# Altium project Pannello.PrjPcb
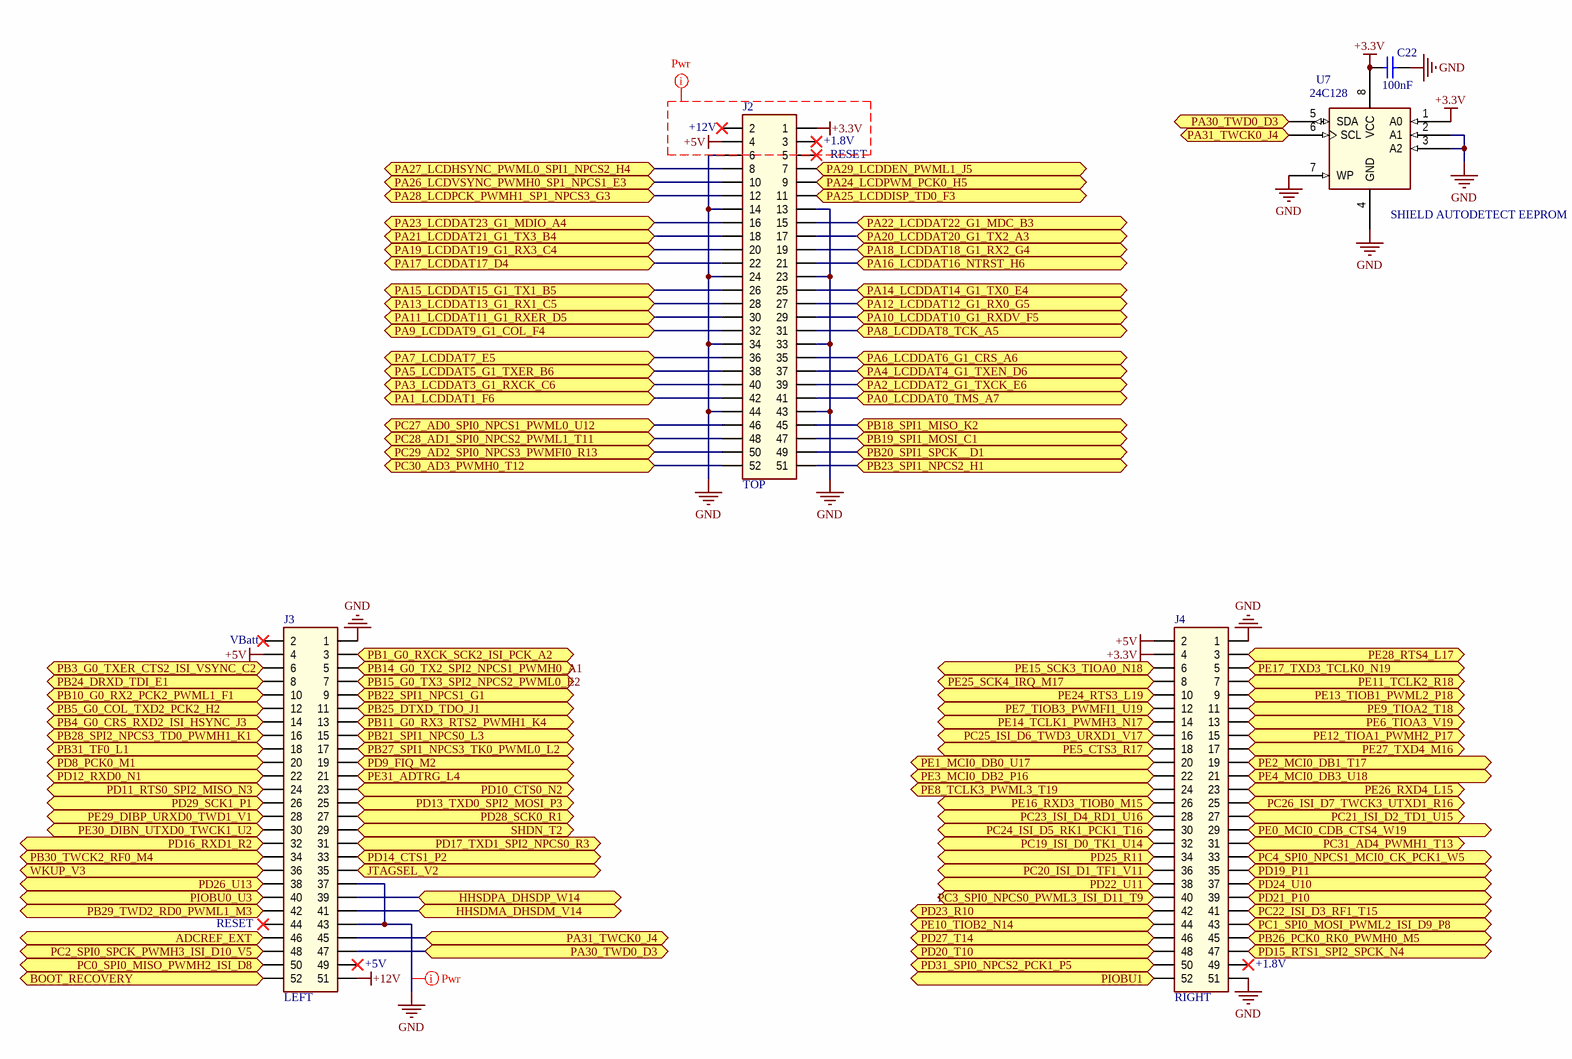
[diagram p0: eva01_connectors.SchDoc]
5 sheets, 242 parts. Net scope: flat (ports and power ports of the same name join across sheets).
Board file: pannello.PcbDoc
Sheets:
  eva01_connectors.SchDoc
  input.SchDoc
  interface.SchDoc
  output.SchDoc
  power.SchDoc

## Sheet eva01_connectors.SchDoc: DevelBoard EVA Main Connectors
size A3; Author: Daniele Basile <asterix@develer.com>; Organization: Develer s.r.l.; Address1: via Mugellese 1/A; Address2: 50019 Campi Bisenzio; Address3: Firenze; Address4: ITALY; DocumentNumber: 1; Revision: EVA 0; SheetNumber: 1; SheetTotal: 3

### Parts
C22  100nF  [0603_[1608]]
J2  TOP  [SOCKET_2x26_2.54MM_THD]
J3  LEFT  [SOCKET_2x26_2.54MM_THD]
J4  RIGHT  [SOCKET_2x26_2.54MM_THD]
U7  24C128  [SOIC8]

### Ports
ADCREF_EXT, BOOT_RECOVERY, HHSDMA_DHSDM_V14, HHSDPA_DHSDP_W14, JTAGSEL_V2, PA0_LCDDAT0_TMS_A7, PA1_LCDDAT1_F6, PA2_LCDDAT2_G1_TXCK_E6, PA3_LCDDAT3_G1_RXCK_C6, PA4_LCDDAT4_G1_TXEN_D6, PA5_LCDDAT5_G1_TXER_B6, PA6_LCDDAT6_G1_CRS_A6, PA7_LCDDAT7_E5, PA8_LCDDAT8_TCK_A5, PA9_LCDDAT9_G1_COL_F4, PA10_LCDDAT10_G1_RXDV_F5, PA11_LCDDAT11_G1_RXER_D5, PA12_LCDDAT12_G1_RX0_G5, PA13_LCDDAT13_G1_RX1_C5, PA14_LCDDAT14_G1_TX0_E4, PA15_LCDDAT15_G1_TX1_B5, PA16_LCDDAT16_NTRST_H6, PA17_LCDDAT17_D4, PA18_LCDDAT18_G1_RX2_G4, PA19_LCDDAT19_G1_RX3_C4, PA20_LCDDAT20_G1_TX2_A3, PA21_LCDDAT21_G1_TX3_B4, PA22_LCDDAT22_G1_MDC_B3, PA23_LCDDAT23_G1_MDIO_A4, PA24_LCDPWM_PCK0_H5, PA25_LCDDISP_TD0_F3, PA26_LCDVSYNC_PWMH0_SP1_NPCS1_E3, PA27_LCDHSYNC_PWML0_SPI1_NPCS2_H4, PA28_LCDPCK_PWMH1_SP1_NPCS3_G3, PA29_LCDDEN_PWML1_J5, PA30_TWD0_D3, PA31_TWCK0_J4, PB1_G0_RXCK_SCK2_ISI_PCK_A2, PB3_G0_TXER_CTS2_ISI_VSYNC_C2, PB4_G0_CRS_RXD2_ISI_HSYNC_J3, PB5_G0_COL_TXD2_PCK2_H2, PB10_G0_RX2_PCK2_PWML1_F1, PB11_G0_RX3_RTS2_PWMH1_K4, PB14_G0_TX2_SPI2_NPCS1_PWMH0_A1, PB15_G0_TX3_SPI2_NPCS2_PWML0_E2, PB18_SPI1_MISO_K2, PB19_SPI1_MOSI_C1, PB20_SPI1_SPCK__D1, PB21_SPI1_NPCS0_L3, PB22_SPI1_NPCS1_G1, PB23_SPI1_NPCS2_H1, PB24_DRXD_TDI_E1, PB25_DTXD_TDO_J1, PB26_PCK0_RK0_PWMH0_M5, PB27_SPI1_NPCS3_TK0_PWML0_L2, PB28_SPI2_NPCS3_TD0_PWMH1_K1, PB29_TWD2_RD0_PWML1_M3, PB30_TWCK2_RF0_M4, PB31_TF0_L1, PC0_SPI0_MISO_PWMH2_ISI_D8, PC1_SPI0_MOSI_PWML2_ISI_D9_P8, PC2_SPI0_SPCK_PWMH3_ISI_D10_V5, PC3_SPI0_NPCS0_PWML3_ISI_D11_T9, PC4_SPI0_NPCS1_MCI0_CK_PCK1_W5, PC19_ISI_D0_TK1_U14, PC20_ISI_D1_TF1_V11, PC21_ISI_D2_TD1_U15, PC22_ISI_D3_RF1_T15, PC23_ISI_D4_RD1_U16, PC24_ISI_D5_RK1_PCK1_T16, PC25_ISI_D6_TWD3_URXD1_V17, PC26_ISI_D7_TWCK3_UTXD1_R16, PC27_AD0_SPI0_NPCS1_PWML0_U12, PC28_AD1_SPI0_NPCS2_PWML1_T11, PC29_AD2_SPI0_NPCS3_PWMFI0_R13, PC30_AD3_PWMH0_T12, PC31_AD4_PWMH1_T13, PD8_PCK0_M1, PD9_FIQ_M2, PD10_CTS0_N2, PD11_RTS0_SPI2_MISO_N3, PD12_RXD0_N1, PD13_TXD0_SPI2_MOSI_P3, PD14_CTS1_P2, PD15_RTS1_SPI2_SPCK_N4, PD16_RXD1_R2, PD17_TXD1_SPI2_NPCS0_R3, PD19_P11, PD20_T10, PD21_P10, PD22_U11, PD23_R10, PD24_U10, PD25_R11, PD26_U13, PD27_T14, PD28_SCK0_R1, PD29_SCK1_P1, PD31_SPI0_NPCS2_PCK1_P5, PE0_MCI0_CDB_CTS4_W19, PE1_MCI0_DB0_U17, PE2_MCI0_DB1_T17, PE3_MCI0_DB2_P16, PE4_MCI0_DB3_U18, PE5_CTS3_R17, PE6_TIOA3_V19, PE7_TIOB3_PWMFI1_U19, PE8_TCLK3_PWML3_T19, PE9_TIOA2_T18, PE10_TIOB2_N14, PE11_TCLK2_R18, PE12_TIOA1_PWMH2_P17, PE13_TIOB1_PWML2_P18, PE14_TCLK1_PWMH3_N17, PE15_SCK3_TIOA0_N18, PE16_RXD3_TIOB0_M15, PE17_TXD3_TCLK0_N19, PE24_RTS3_L19, PE25_SCK4_IRQ_M17, PE26_RXD4_L15, PE27_TXD4_M16, PE28_RTS4_L17, PE29_DIBP_URXD0_TWD1_V1, PE30_DIBN_UTXD0_TWCK1_U2, PE31_ADTRG_L4, PIOBU0_U3, PIOBU1, SHDN_T2, WKUP_V3

### Nets
+3.3V: C22.2 J2.1 J4.4 U7.1(A0) U7.8(VCC)
+5V: J2.4 J3.4 J4.2
+12V: J3.51
GND: C22.1 J2.6 J2.13 J2.14 J2.23 J2.24 J2.33 J2.34 J2.43 J2.44 J3.1 J3.37 J3.43 J4.1 J4.51 U7.2(A1) U7.3(A2) U7.4(GND) U7.7(WP)
NetJ2_7: J2.7 ; port PA29_LCDDEN_PWML1_J5
NetJ2_8: J2.8 ; port PA27_LCDHSYNC_PWML0_SPI1_NPCS2_H4
NetJ2_9: J2.9 ; port PA24_LCDPWM_PCK0_H5
NetJ2_10: J2.10 ; port PA26_LCDVSYNC_PWMH0_SP1_NPCS1_E3
NetJ2_11: J2.11 ; port PA25_LCDDISP_TD0_F3
NetJ2_12: J2.12 ; port PA28_LCDPCK_PWMH1_SP1_NPCS3_G3
NetJ2_15: J2.15 ; port PA22_LCDDAT22_G1_MDC_B3
NetJ2_16: J2.16 ; port PA23_LCDDAT23_G1_MDIO_A4
NetJ2_17: J2.17 ; port PA20_LCDDAT20_G1_TX2_A3
NetJ2_18: J2.18 ; port PA21_LCDDAT21_G1_TX3_B4
NetJ2_19: J2.19 ; port PA18_LCDDAT18_G1_RX2_G4
NetJ2_20: J2.20 ; port PA19_LCDDAT19_G1_RX3_C4
NetJ2_21: J2.21 ; port PA16_LCDDAT16_NTRST_H6
NetJ2_22: J2.22 ; port PA17_LCDDAT17_D4
NetJ2_25: J2.25 ; port PA14_LCDDAT14_G1_TX0_E4
NetJ2_26: J2.26 ; port PA15_LCDDAT15_G1_TX1_B5
NetJ2_27: J2.27 ; port PA12_LCDDAT12_G1_RX0_G5
NetJ2_28: J2.28 ; port PA13_LCDDAT13_G1_RX1_C5
NetJ2_29: J2.29 ; port PA10_LCDDAT10_G1_RXDV_F5
NetJ2_30: J2.30 ; port PA11_LCDDAT11_G1_RXER_D5
NetJ2_31: J2.31 ; port PA8_LCDDAT8_TCK_A5
NetJ2_32: J2.32 ; port PA9_LCDDAT9_G1_COL_F4
NetJ2_35: J2.35 ; port PA6_LCDDAT6_G1_CRS_A6
NetJ2_36: J2.36 ; port PA7_LCDDAT7_E5
NetJ2_37: J2.37 ; port PA4_LCDDAT4_G1_TXEN_D6
NetJ2_38: J2.38 ; port PA5_LCDDAT5_G1_TXER_B6
NetJ2_39: J2.39 ; port PA2_LCDDAT2_G1_TXCK_E6
NetJ2_40: J2.40 ; port PA3_LCDDAT3_G1_RXCK_C6
NetJ2_41: J2.41 ; port PA0_LCDDAT0_TMS_A7
NetJ2_42: J2.42 ; port PA1_LCDDAT1_F6
NetJ2_45: J2.45 ; port PB18_SPI1_MISO_K2
NetJ2_46: J2.46 ; port PC27_AD0_SPI0_NPCS1_PWML0_U12
NetJ2_47: J2.47 ; port PB19_SPI1_MOSI_C1
NetJ2_48: J2.48 ; port PC28_AD1_SPI0_NPCS2_PWML1_T11
NetJ2_49: J2.49 ; port PB20_SPI1_SPCK__D1
NetJ2_50: J2.50 ; port PC29_AD2_SPI0_NPCS3_PWMFI0_R13
NetJ2_51: J2.51 ; port PB23_SPI1_NPCS2_H1
NetJ2_52: J2.52 ; port PC30_AD3_PWMH0_T12
NetJ3_3: J3.3 ; port PB1_G0_RXCK_SCK2_ISI_PCK_A2
NetJ3_5: J3.5 ; port PB14_G0_TX2_SPI2_NPCS1_PWMH0_A1
NetJ3_6: J3.6 ; port PB3_G0_TXER_CTS2_ISI_VSYNC_C2
NetJ3_7: J3.7 ; port PB15_G0_TX3_SPI2_NPCS2_PWML0_E2
NetJ3_8: J3.8 ; port PB24_DRXD_TDI_E1
NetJ3_9: J3.9 ; port PB22_SPI1_NPCS1_G1
NetJ3_10: J3.10 ; port PB10_G0_RX2_PCK2_PWML1_F1
NetJ3_11: J3.11 ; port PB25_DTXD_TDO_J1
NetJ3_12: J3.12 ; port PB5_G0_COL_TXD2_PCK2_H2
NetJ3_13: J3.13 ; port PB11_G0_RX3_RTS2_PWMH1_K4
NetJ3_14: J3.14 ; port PB4_G0_CRS_RXD2_ISI_HSYNC_J3
NetJ3_15: J3.15 ; port PB21_SPI1_NPCS0_L3
NetJ3_16: J3.16 ; port PB28_SPI2_NPCS3_TD0_PWMH1_K1
NetJ3_17: J3.17 ; port PB27_SPI1_NPCS3_TK0_PWML0_L2
NetJ3_18: J3.18 ; port PB31_TF0_L1
NetJ3_19: J3.19 ; port PD9_FIQ_M2
NetJ3_20: J3.20 ; port PD8_PCK0_M1
NetJ3_21: J3.21 ; port PE31_ADTRG_L4
NetJ3_22: J3.22 ; port PD12_RXD0_N1
NetJ3_23: J3.23 ; port PD10_CTS0_N2
NetJ3_24: J3.24 ; port PD11_RTS0_SPI2_MISO_N3
NetJ3_25: J3.25 ; port PD13_TXD0_SPI2_MOSI_P3
NetJ3_26: J3.26 ; port PD29_SCK1_P1
NetJ3_27: J3.27 ; port PD28_SCK0_R1
NetJ3_28: J3.28 ; port PE29_DIBP_URXD0_TWD1_V1
NetJ3_29: J3.29 ; port SHDN_T2
NetJ3_30: J3.30 ; port PE30_DIBN_UTXD0_TWCK1_U2
NetJ3_31: J3.31 ; port PD17_TXD1_SPI2_NPCS0_R3
NetJ3_32: J3.32 ; port PD16_RXD1_R2
NetJ3_33: J3.33 ; port PD14_CTS1_P2
NetJ3_34: J3.34 ; port PB30_TWCK2_RF0_M4
NetJ3_35: J3.35 ; port JTAGSEL_V2
NetJ3_36: J3.36 ; port WKUP_V3
NetJ3_38: J3.38 ; port PD26_U13
NetJ3_39: J3.39 ; port HHSDPA_DHSDP_W14
NetJ3_40: J3.40 ; port PIOBU0_U3
NetJ3_41: J3.41 ; port HHSDMA_DHSDM_V14
NetJ3_42: J3.42 ; port PB29_TWD2_RD0_PWML1_M3
NetJ3_45: J3.45 U7.6(SCL) ; port PA31_TWCK0_J4
NetJ3_46: J3.46 ; port ADCREF_EXT
NetJ3_47: J3.47 U7.5(SDA) ; port PA30_TWD0_D3
NetJ3_48: J3.48 ; port PC2_SPI0_SPCK_PWMH3_ISI_D10_V5
NetJ3_50: J3.50 ; port PC0_SPI0_MISO_PWMH2_ISI_D8
NetJ3_52: J3.52 ; port BOOT_RECOVERY
NetJ4_3: J4.3 ; port PE28_RTS4_L17
NetJ4_5: J4.5 ; port PE17_TXD3_TCLK0_N19
NetJ4_6: J4.6 ; port PE15_SCK3_TIOA0_N18
NetJ4_7: J4.7 ; port PE11_TCLK2_R18
NetJ4_8: J4.8 ; port PE25_SCK4_IRQ_M17
NetJ4_9: J4.9 ; port PE13_TIOB1_PWML2_P18
NetJ4_10: J4.10 ; port PE24_RTS3_L19
NetJ4_11: J4.11 ; port PE9_TIOA2_T18
NetJ4_12: J4.12 ; port PE7_TIOB3_PWMFI1_U19
NetJ4_13: J4.13 ; port PE6_TIOA3_V19
NetJ4_14: J4.14 ; port PE14_TCLK1_PWMH3_N17
NetJ4_15: J4.15 ; port PE12_TIOA1_PWMH2_P17
NetJ4_16: J4.16 ; port PC25_ISI_D6_TWD3_URXD1_V17
NetJ4_17: J4.17 ; port PE27_TXD4_M16
NetJ4_18: J4.18 ; port PE5_CTS3_R17
NetJ4_19: J4.19 ; port PE2_MCI0_DB1_T17
NetJ4_20: J4.20 ; port PE1_MCI0_DB0_U17
NetJ4_21: J4.21 ; port PE4_MCI0_DB3_U18
NetJ4_22: J4.22 ; port PE3_MCI0_DB2_P16
NetJ4_23: J4.23 ; port PE26_RXD4_L15
NetJ4_24: J4.24 ; port PE8_TCLK3_PWML3_T19
NetJ4_25: J4.25 ; port PC26_ISI_D7_TWCK3_UTXD1_R16
NetJ4_26: J4.26 ; port PE16_RXD3_TIOB0_M15
NetJ4_27: J4.27 ; port PC21_ISI_D2_TD1_U15
NetJ4_28: J4.28 ; port PC23_ISI_D4_RD1_U16
NetJ4_29: J4.29 ; port PE0_MCI0_CDB_CTS4_W19
NetJ4_30: J4.30 ; port PC24_ISI_D5_RK1_PCK1_T16
NetJ4_31: J4.31 ; port PC31_AD4_PWMH1_T13
NetJ4_32: J4.32 ; port PC19_ISI_D0_TK1_U14
NetJ4_33: J4.33 ; port PC4_SPI0_NPCS1_MCI0_CK_PCK1_W5
NetJ4_34: J4.34 ; port PD25_R11
NetJ4_35: J4.35 ; port PD19_P11
NetJ4_36: J4.36 ; port PC20_ISI_D1_TF1_V11
NetJ4_37: J4.37 ; port PD24_U10
NetJ4_38: J4.38 ; port PD22_U11
NetJ4_39: J4.39 ; port PD21_P10
NetJ4_40: J4.40 ; port PC3_SPI0_NPCS0_PWML3_ISI_D11_T9
NetJ4_41: J4.41 ; port PC22_ISI_D3_RF1_T15
NetJ4_42: J4.42 ; port PD23_R10
NetJ4_43: J4.43 ; port PC1_SPI0_MOSI_PWML2_ISI_D9_P8
NetJ4_44: J4.44 ; port PE10_TIOB2_N14
NetJ4_45: J4.45 ; port PB26_PCK0_RK0_PWMH0_M5
NetJ4_46: J4.46 ; port PD27_T14
NetJ4_47: J4.47 ; port PD15_RTS1_SPI2_SPCK_N4
NetJ4_48: J4.48 ; port PD20_T10
NetJ4_50: J4.50 ; port PD31_SPI0_NPCS2_PCK1_P5
NetJ4_52: J4.52 ; port PIOBU1

Not connected (* = marked no-connect by the designer): J2 2* 3* 5*; J3 2* 44* 49*; J4 49*

### Layout directives
net class Power: +3.3V, +5V, GND

### Notes on the sheet
- (near J2) +12V
- (near J2) +1.8V
- (near J2) RESET
- (near U7) SHIELD AUTODETECT EEPROM
- (near J3) VBatt
- (near J3) RESET
- (near J3) +5V
- (near J4) +1.8V
- Title:
- Author:
- License:
- BSD
- Rev:
- Size:
- A3
- File:
- Date:
- Time:
- Sheet
- of

### Library data of the parts
C22 = Cap: Ceramic X7R 50V; Value: 10nF; Published: 8-Jun-2000; Revision: July-2002: Re-released for DXP Platform.; Publisher: Altium Limited
J2-J4 = Header 26x2: Socket Header, 52 pin, 26x2, 2.54mm, H=8.5mm; Part Number: Tyco 1-1634688; Purchase Code: RS 473-8254
U7 = EEPROM-SOIC8: EEPROM

## Sheet input.SchDoc: PISO input board
size A3; Author: Francesco Sacchi <batt@develer.com>; Organization: Develer s.r.l.; Address1: via Mugellese 1/A; Address2: 50019 Campi Bisenzio; Address3: Firenze; Address4: ITALY; DocumentNumber: 1; Revision: 0; SheetNumber: 1; SheetTotal: 6
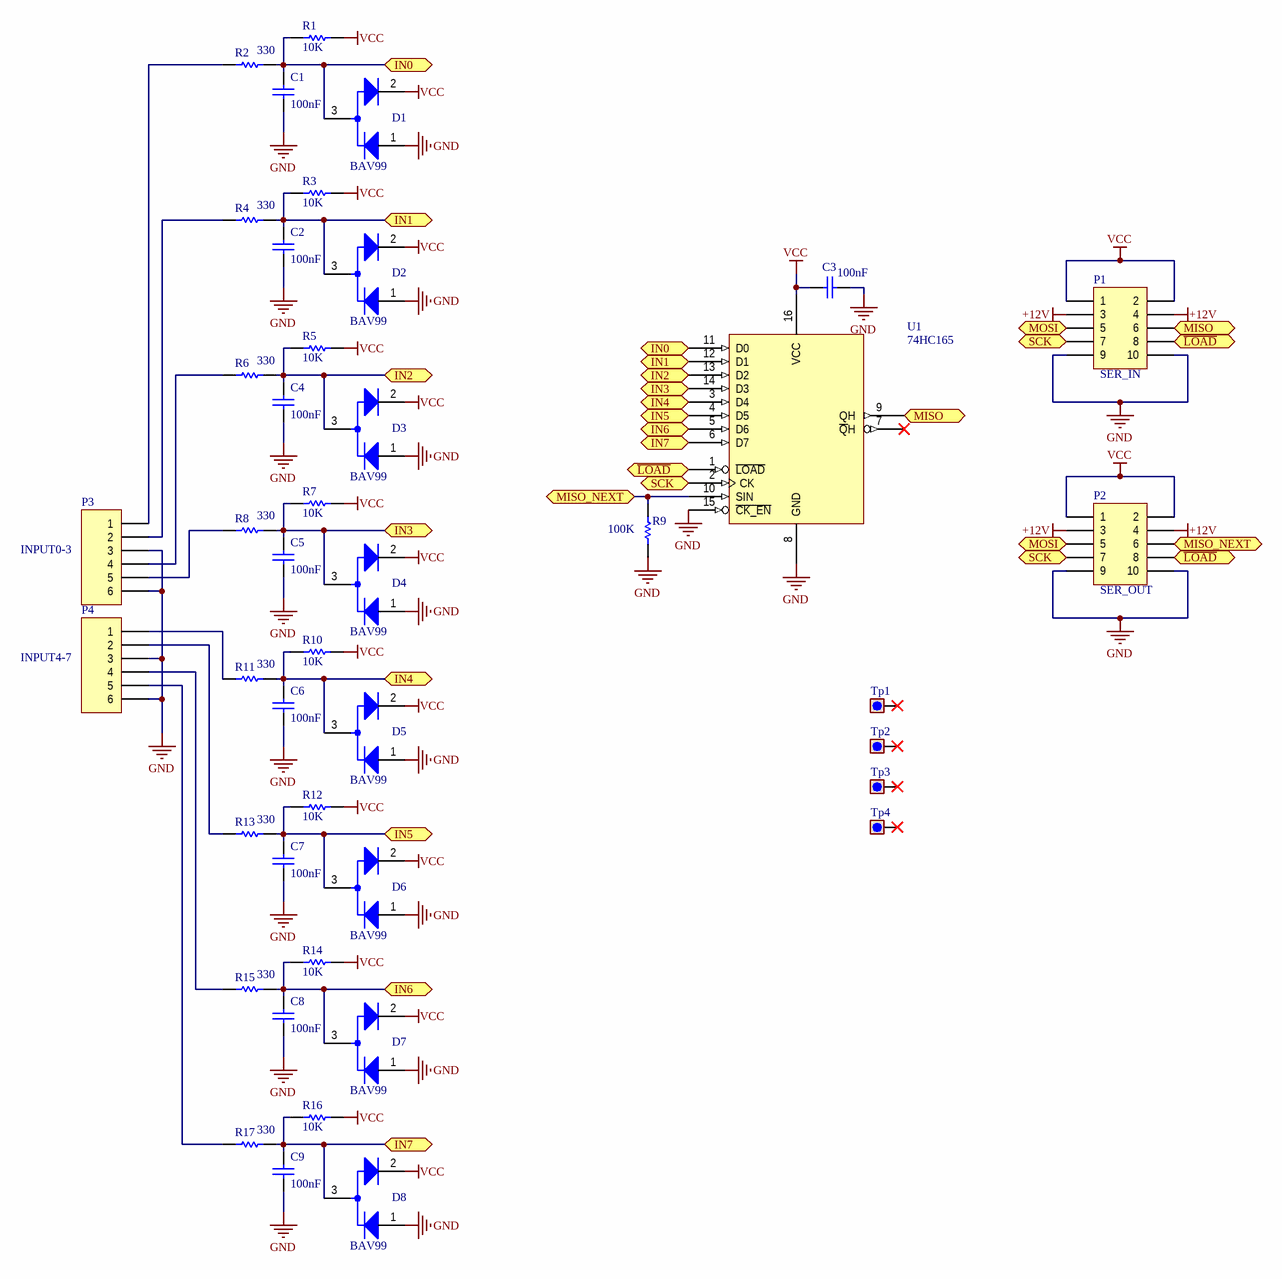
[diagram p1: input.SchDoc]

### Parts
(Parts that share a designator on the sheet are numbered #1, #2 ... from top to bottom, then left to right.)
C1#1  100nF  [0603_[1608]]
C2#1  100nF  [0603_[1608]]
C3#1  100nF  [0603_[1608]]
C4#1  100nF  [0603_[1608]]
C5#1  100nF  [0603_[1608]]
C6#1  100nF  [0603_[1608]]
C7#1  100nF  [0603_[1608]]
C8#1  100nF  [0603_[1608]]
C9#1  100nF  [0603_[1608]]
D1#1  BAV99  [SOT-23]
D2#1  BAV99  [SOT-23]
D3#1  BAV99  [SOT-23]
D4#1  BAV99  [SOT-23]
D5#1  BAV99  [SOT-23]
D6#1  BAV99  [SOT-23]
D7  BAV99  [SOT-23]
D8  BAV99  [SOT-23]
P1#1  SER_IN  [HEADER_2X5_2.54MM_THD_BOXED]
P2#1  SER_OUT  [HEADER_2X5_2.54MM_THD_BOXED]
P3#1  INPUT0-3  [TBLOCK_1X6_3.5MM_HOR_THD]
P4#1  INPUT4-7  [TBLOCK_1X6_3.5MM_HOR_THD]
R1#1  10K  [0603_[1608]]
R2#1  330  [0603_[1608]]
R3#1  10K  [0603_[1608]]
R4#1  330  [0603_[1608]]
R5#1  10K  [0603_[1608]]
R6#1  330  [0603_[1608]]
R7#1  10K  [0603_[1608]]
R8#1  330  [0603_[1608]]
R9#1  100K  [0603_[1608]]
R10#1  10K  [0603_[1608]]
R11#1  330  [0603_[1608]]
R12#1  10K  [0603_[1608]]
R13#1  330  [0603_[1608]]
R14#1  10K  [0603_[1608]]
R15#1  330  [0603_[1608]]
R16#1  10K  [0603_[1608]]
R17#1  330  [0603_[1608]]
Tp1#1  (no value)  [Hole_M3x6mm]  (no BOM)
Tp2#1  (no value)  [Hole_M3x6mm]  (no BOM)
Tp3#1  (no value)  [Hole_M3x6mm]  (no BOM)
Tp4#1  (no value)  [Hole_M3x6mm]  (no BOM)
U1#1  74HC165  [SOIC16]

### Ports
IN0, IN1, IN2, IN3, IN4, IN5, IN6, IN7, MISO, MISO_NEXT, MOSI, SCK, ~{LOAD}

### Nets
+12V: P1#1.3 P1#1.4 P2#1.3 P2#1.4
GND: C1#1.1 C2#1.1 C3#1.1 C4#1.1 C5#1.1 C6#1.1 C7#1.1 C8#1.1 C9#1.1 D1#1.1 D2#1.1 D3#1.1 D4#1.1 D5#1.1 D6#1.1 D7.1 D8.1 P1#1.9 P1#1.10 P2#1.9 P2#1.10 P3#1.3 P3#1.6 P4#1.3 P4#1.6 R9#1.1 U1#1.8(GND) U1#1.15(~{CK_EN})
VCC: C3#1.2 D1#1.2 D2#1.2 D3#1.2 D4#1.2 D5#1.2 D6#1.2 D7.2 D8.2 P1#1.1 P1#1.2 P2#1.1 P2#1.2 R1#1.2 R3#1.2 R5#1.2 R7#1.2 R10#1.2 R12#1.2 R14#1.2 R16#1.2 U1#1.16(VCC)
NetC1#1_2: C1#1.2 D1#1.3 R1#1.1 R2#1.1 U1#1.11(D0) ; port IN0
NetC2#1_2: C2#1.2 D2#1.3 R3#1.1 R4#1.1 U1#1.12(D1) ; port IN1
NetC4#1_2: C4#1.2 D3#1.3 R5#1.1 R6#1.1 U1#1.13(D2) ; port IN2
NetC5#1_2: C5#1.2 D4#1.3 R7#1.1 R8#1.1 U1#1.14(D3) ; port IN3
NetC6#1_2: C6#1.2 D5#1.3 R10#1.1 R11#1.1 U1#1.3(D4) ; port IN4
NetC7#1_2: C7#1.2 D6#1.3 R12#1.1 R13#1.1 U1#1.4(D5) ; port IN5
NetC8#1_2: C8#1.2 D7.3 R14#1.1 R15#1.1 U1#1.5(D6) ; port IN6
NetC9#1_2: C9#1.2 D8.3 R16#1.1 R17#1.1 U1#1.6(D7) ; port IN7
NetP1#1_5: P1#1.5 P2#1.5 ; port MOSI
NetP1#1_6: P1#1.6 U1#1.9(QH) ; port MISO
NetP1#1_7: P1#1.7 P2#1.7 U1#1.2(CK) ; port SCK
NetP1#1_8: P1#1.8 P2#1.8 U1#1.1(~{LOAD}) ; port ~{LOAD}
NetP2#1_6: P2#1.6 R9#1.2 U1#1.10(SIN) ; port MISO_NEXT
NetP3#1_1: P3#1.1 R2#1.2
NetP3#1_2: P3#1.2 R4#1.2
NetP3#1_4: P3#1.4 R6#1.2
NetP3#1_5: P3#1.5 R8#1.2
NetP4#1_1: P4#1.1 R11#1.2
NetP4#1_2: P4#1.2 R13#1.2
NetP4#1_4: P4#1.4 R15#1.2
NetP4#1_5: P4#1.5 R17#1.2

Not connected (* = marked no-connect by the designer): Tp1#1 1*; Tp2#1 1*; Tp3#1 1*; Tp4#1 1*; U1#1 7(~{Q}H)*

### Notes on the sheet
- Title:
- Author:
- License:
- BSD
- Rev:
- Size:
- A3
- File:
- Date:
- Time:
- Sheet
- of

### Library data of the parts
C1#1 C2#1 C3#1 C4#1 C5#1 C6#1 C7#1 C8#1 C9#1 = Cap: Ceramic X5R 6.3V, 10V; Value: 10nF; Published: 8-Jun-2000; Revision: July-2002: Re-released for DXP Platform.; Publisher: Altium Limited
D1#1 D2#1 D3#1 D4#1 D5#1 D6#1 D7 D8 = BAV99: SOT23
P1#1 P2#1 = Header 5X2: Header, 5-Pin, Dual row; LatestRevisionDate: 17-Jul-2002; LatestRevisionNote: Re-released for DXP Platform.; Publisher: Altium Limited
P3#1 P4#1 = Header 6: Header, 6-Pin; LatestRevisionDate: 17-Jul-2002; LatestRevisionNote: Re-released for DXP Platform.; Publisher: Altium Limited
R1#1 R2#1 R3#1 R4#1 R5#1 R6#1 R7#1 R8#1 R9#1 R10#1 R11#1 R12#1 R13#1 R14#1 R15#1 R16#1 R17#1 = Res1: Resistor; Value: 1K; Published: 8-Jun-2000; Revision: July-2002: Re-released for DXP Platform.; Publisher: Altium Limited
Tp1#1 Tp2#1 Tp3#1 Tp4#1 = Test_point

## Sheet interface.SchDoc: Interface
size A3; Author: Francesco Sacchi <batt@develer.com>; Organization: Develer s.r.l.; Address1: via Mugellese 1/A; Address2: 50019 Campi Bisenzio; Address3: Firenze; Address4: ITALY; DocumentNumber: 1; Revision: 0; SheetNumber: 1; SheetTotal: 6
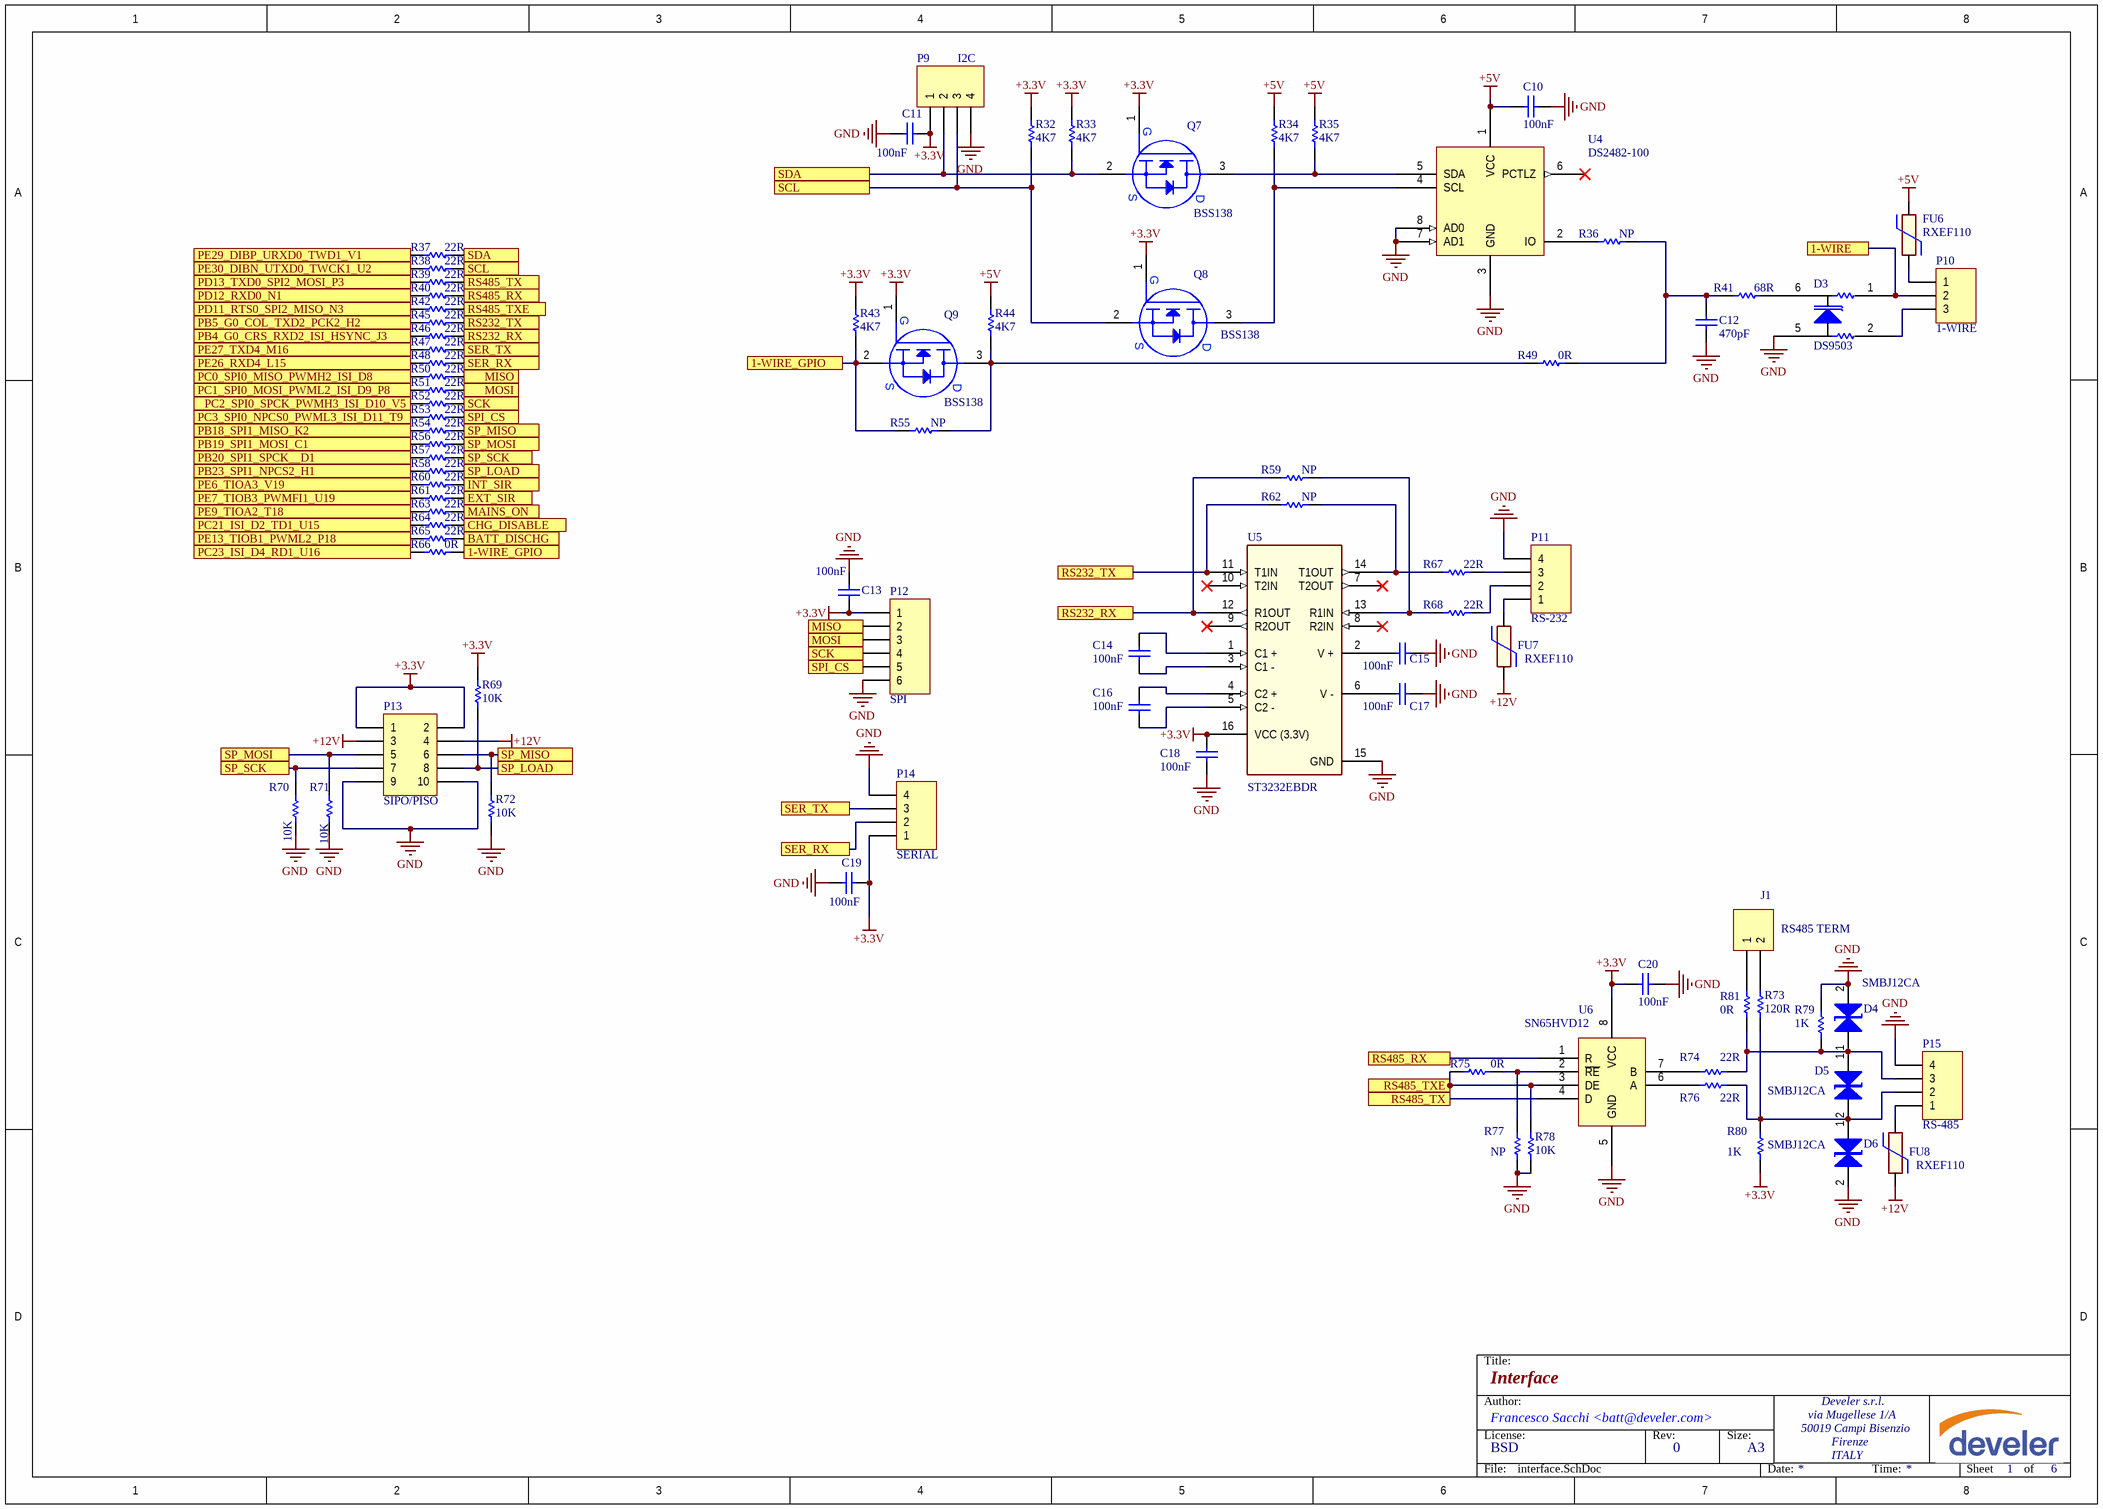
[diagram p2: interface.SchDoc]

### Parts
(Parts that share a designator on the sheet are numbered #1, #2 ... from top to bottom, then left to right.)
C10  100nF  [0603_[1608]]
C11  100nF  [0603_[1608]]
C12  470pF  [0603_[1608]]
C13  100nF  [0603_[1608]]
C14  100nF  [0603_[1608]]
C15  100nF  [0603_[1608]]
C16  100nF  [0603_[1608]]
C17  100nF  [0603_[1608]]
C18  100nF  [0603_[1608]]
C19  100nF  [0603_[1608]]
C20  100nF  [0603_[1608]]
D3#2  DS9503  [TSOC6]
D4#2  SMBJ12CA  [DO214AA_12]
D5#2  SMBJ12CA  [DO214AA_12]
D6#2  SMBJ12CA  [DO214AA_12]
FU6  RXEF110  [RADIAL_5.08mm_polyswitch]
FU7  RXEF110  [RADIAL_5.08mm_polyswitch]
FU8  RXEF110  [RADIAL_5.08mm_polyswitch]
J1  RS485 TERM  [HEADER_1X2_2.54MM_THD]
P9  I2C  [HEADER_1X4_2.54MM_THD]
P10  1-WIRE  [TBLOCK_1X3_3.5MM_HOR_THD]
P11  RS-232  [TBLOCK_1X4_3.5MM_HOR_THD]
P12  SPI  [HEADER_1X6_2.54MM_THD]
P13  SIPO/PISO  [HEADER_2X5_2.54MM_THD_BOXED]
P14  SERIAL  [HEADER_1X4_2.54MM_THD]
P15  RS-485  [TBLOCK_1X4_3.5MM_HOR_THD]
Q7  BSS138  [sot-23]
Q8  BSS138  [sot-23]
Q9  BSS138  [sot-23]
R32  4K7  [0603_[1608]]
R33  4K7  [0603_[1608]]
R34  4K7  [0603_[1608]]
R35  4K7  [0603_[1608]]
R36  NP  [0603_[1608]]
R37  22R  [0603_[1608]]
R38  22R  [0603_[1608]]
R39  22R  [0603_[1608]]
R40  22R  [0603_[1608]]
R41  68R  [0603_[1608]]
R42  22R  [0603_[1608]]
R43  4K7  [0603_[1608]]
R44  4K7  [0603_[1608]]
R45  22R  [0603_[1608]]
R46  22R  [0603_[1608]]
R47  22R  [0603_[1608]]
R48  22R  [0603_[1608]]
R49  0R  [0603_[1608]]
R50  22R  [0603_[1608]]
R51  22R  [0603_[1608]]
R52  22R  [0603_[1608]]
R53  22R  [0603_[1608]]
R54  22R  [0603_[1608]]
R55  NP  [0603_[1608]]
R56  22R  [0603_[1608]]
R57  22R  [0603_[1608]]
R58  22R  [0603_[1608]]
R59  NP  [0603_[1608]]
R60  22R  [0603_[1608]]
R61  22R  [0603_[1608]]
R62  NP  [0603_[1608]]
R63  22R  [0603_[1608]]
R64  22R  [0603_[1608]]
R65  22R  [0603_[1608]]
R66  0R  [0603_[1608]]
R67  22R  [0603_[1608]]
R68  22R  [0603_[1608]]
R69  10K  [0603_[1608]]
R70  10K  [0603_[1608]]
R71  10K  [0603_[1608]]
R72  10K  [0603_[1608]]
R73  120R  [0603_[1608]]
R74  22R  [0603_[1608]]
R75  0R  [0603_[1608]]
R76  22R  [0603_[1608]]
R77  NP  [0603_[1608]]
R78  10K  [0603_[1608]]
R79  1K  [0603_[1608]]
R80  1K  [0603_[1608]]
R81  0R  [0603_[1608]]
U4  DS2482-100  [SOIC8]
U5  ST3232EBDR  [SOIC16]
U6  SN65HVD12  [SOIC8]

### Ports
1-WIRE, 1-WIRE_GPIO, BATT_DISCHG, CHG_DISABLE, EXT_SIR, INT_SIR, MAINS_ON, MISO, MOSI, PB4_G0_CRS_RXD2_ISI_HSYNC_J3, PB5_G0_COL_TXD2_PCK2_H2, PB18_SPI1_MISO_K2, PB19_SPI1_MOSI_C1, PB20_SPI1_SPCK__D1, PB23_SPI1_NPCS2_H1, PC0_SPI0_MISO_PWMH2_ISI_D8, PC1_SPI0_MOSI_PWML2_ISI_D9_P8, PC2_SPI0_SPCK_PWMH3_ISI_D10_V5, PC3_SPI0_NPCS0_PWML3_ISI_D11_T9, PC21_ISI_D2_TD1_U15, PC23_ISI_D4_RD1_U16, PD11_RTS0_SPI2_MISO_N3, PD12_RXD0_N1, PD13_TXD0_SPI2_MOSI_P3, PE6_TIOA3_V19, PE7_TIOB3_PWMFI1_U19, PE9_TIOA2_T18, PE13_TIOB1_PWML2_P18, PE26_RXD4_L15, PE27_TXD4_M16, PE29_DIBP_URXD0_TWD1_V1, PE30_DIBN_UTXD0_TWCK1_U2, RS232_RX, RS232_TX, RS485_RX, RS485_TX, RS485_TXE, SCK, SCL, SDA, SER_RX, SER_TX, SP_LOAD, SP_MISO, SP_MOSI, SP_SCK, SPI_CS

### Nets
+3.3V: C11.2 C13.2 C18.2 C19.2 C20.2 P9.1 P12.1 P13.1 P13.2 P14.1 Q7.1(G) Q8.1(G) Q9.1(G) R32.2 R33.2 R43.2 R69.2 R80.1 U5.16(VCC_(3.3V)) U6.8(VCC)
+5V: C10.2 FU6.1 R34.2 R35.2 R44.2 U4.1(VCC)
+12V: FU7.1 FU8.1 P13.3 P13.4
GND: C10.1 C11.1 C12.2 C13.1 C15.1 C17.1 C18.1 C19.1 C20.1 D3#2.5 D4#2.2 D6#2.2 P9.4 P11.4 P12.6 P13.9 P13.10 P14.4 P15.4 R70.1 R71.1 R72.1 R77.1 R78.1 R79.2 U4.3(GND) U4.7(AD1) U4.8(AD0) U5.15(GND) U6.5(GND)
NetC12_1: C12.1 R36.2 R41.1 R49.2
NetC14_1: C14.1 U5.1(C1_+)
NetC14_2: C14.2 U5.3(C1_-)
NetC15_2: C15.2 U5.2(V_+)
NetC16_1: C16.1 U5.5(C2_-)
NetC16_2: C16.2 U5.4(C2_+)
NetC17_2: C17.2 U5.6(V_-)
NetD3#2_1: D3#2.1 P10.2 ; port 1-WIRE
NetD3#2_2: D3#2.2 P10.3
NetD3#2_6: D3#2.6 R41.2
NetD4#2_1: D4#2.1 D5#2.1 P15.3 R74.2 R79.1 R81.2
NetD5#2_2: D5#2.2 D6#2.1 P15.2 R73.2 R76.2 R80.2
NetDZ4_3: R63.2 ; port MAINS_ON
NetFU6_2: FU6.2 P10.1
NetFU7_2: FU7.2 P11.1
NetFU8_2: FU8.2 P15.1
NetJ1_1: J1.1 R81.1
NetJ1_2: J1.2 R73.1
NetJ2_45: R54.1 ; port PB18_SPI1_MISO_K2
NetJ2_47: R56.1 ; port PB19_SPI1_MOSI_C1
NetJ2_49: R57.1 ; port PB20_SPI1_SPCK__D1
NetJ2_51: R58.1 ; port PB23_SPI1_NPCS2_H1
NetJ3_12: R45.1 ; port PB5_G0_COL_TXD2_PCK2_H2
NetJ3_14: R46.1 ; port PB4_G0_CRS_RXD2_ISI_HSYNC_J3
NetJ3_22: R40.1 ; port PD12_RXD0_N1
NetJ3_24: R42.1 ; port PD11_RTS0_SPI2_MISO_N3
NetJ3_25: R39.1 ; port PD13_TXD0_SPI2_MOSI_P3
NetJ3_28: R37.1 ; port PE29_DIBP_URXD0_TWD1_V1
NetJ3_30: R38.1 ; port PE30_DIBN_UTXD0_TWCK1_U2
NetJ3_48: R52.1 ; port PC2_SPI0_SPCK_PWMH3_ISI_D10_V5
NetJ3_50: R50.1 ; port PC0_SPI0_MISO_PWMH2_ISI_D8
NetJ4_9: R65.1 ; port PE13_TIOB1_PWML2_P18
NetJ4_11: R63.1 ; port PE9_TIOA2_T18
NetJ4_12: R61.1 ; port PE7_TIOB3_PWMFI1_U19
NetJ4_13: R60.1 ; port PE6_TIOA3_V19
NetJ4_17: R47.1 ; port PE27_TXD4_M16
NetJ4_23: R48.1 ; port PE26_RXD4_L15
NetJ4_27: R64.1 ; port PC21_ISI_D2_TD1_U15
NetJ4_28: R66.1 ; port PC23_ISI_D4_RD1_U16
NetJ4_40: R53.1 ; port PC3_SPI0_NPCS0_PWML3_ISI_D11_T9
NetJ4_43: R51.1 ; port PC1_SPI0_MOSI_PWML2_ISI_D9_P8
NetP1#1_5: P12.3 R51.2 ; port MOSI
NetP1#1_6: P12.2 R50.2 ; port MISO
NetP1#1_7: P12.4 R52.2 ; port SCK
NetP9_2: P9.2 Q7.2(S) R33.1 R37.2 ; port SDA
NetP9_3: P9.3 Q8.2(S) R32.1 R38.2 ; port SCL
NetP11_2: P11.2 R68.2
NetP11_3: P11.3 R67.2
NetP12_5: P12.5 R53.2 ; port SPI_CS
NetP13_5: P13.5 R56.2 R71.2 ; port SP_MOSI
NetP13_6: P13.6 R54.2 R72.2 ; port SP_MISO
NetP13_7: P13.7 R57.2 R70.2 ; port SP_SCK
NetP13_8: P13.8 R58.2 R69.1 ; port SP_LOAD
NetP14_2: P14.2 R48.2 ; port SER_RX
NetP14_3: P14.3 R47.2 ; port SER_TX
NetQ7_3: Q7.3(D) R35.1 U4.5(SDA)
NetQ8_3: Q8.3(D) R34.1 U4.4(SCL)
NetQ9_2: Q9.2(S) R43.1 R55.1 R66.2 ; port 1-WIRE_GPIO
NetQ9_3: Q9.3(D) R44.1 R49.1 R55.2
NetR19_1: R64.2 ; port CHG_DISABLE
NetR26_1: R60.2 ; port INT_SIR
NetR27_1: R65.2 ; port BATT_DISCHG
NetR30_1: R61.2 ; port EXT_SIR
NetR36_1: R36.1 U4.2(IO)
NetR39_2: R39.2 U6.4(D) ; port RS485_TX
NetR40_2: R40.2 U6.1(R) ; port RS485_RX
NetR42_2: R42.2 R75.2 R78.2 U6.3(DE) ; port RS485_TXE
NetR45_2: R45.2 R62.1 U5.11(T1IN) ; port RS232_TX
NetR46_2: R46.2 R59.1 U5.12(R1OUT) ; port RS232_RX
NetR59_2: R59.2 R68.1 U5.13(R1IN)
NetR62_2: R62.2 R67.1 U5.14(T1OUT)
NetR74_1: R74.1 U6.7(B)
NetR75_1: R75.1 R77.2 U6.2(~{RE})
NetR76_1: R76.1 U6.6(A)

Not connected (* = marked no-connect by the designer): U4 6(PCTLZ)*; U5 7(T2OUT)* 8(R2IN)* 9(R2OUT)* 10(T2IN)*

### Notes on the sheet
- Title:
- Author:
- License:
- BSD
- Rev:
- Size:
- A3
- File:
- Date:
- Time:
- Sheet
- of

### Library data of the parts
C10-C20 = Cap: Ceramic X7R 50V; Value: 100pF; Published: 8-Jun-2000; LatestRevisionDate: 17-Jul-2002; LatestRevisionNote: Re-released for DXP Platform.; PackageReference: RAD-0.3; Publisher: Altium Limited; PackageDescription: Radial Cap, Thru-Hole; 2 Leads; 0.3 in Pin Spacing
D3#2 = DS9503: ESD Protection Diode with Resistors
D4#2 D5#2 D6#2 = TVS bi: TVS bidirectional
FU6-FU8 = FuseAutoReset: Fuse autoreset
J1 = Header 2: Pin Header, 2.54mm, 1x2, 2pin; LatestRevisionDate: 17-Jul-2002; LatestRevisionNote: Re-released for DXP Platform.; Publisher: Altium Limited
P9 P11 P14 P15 = Header 4: Header, 4-Pin; LatestRevisionDate: 17-Jul-2002; LatestRevisionNote: Re-released for DXP Platform.; Publisher: Altium Limited
P10 = Header 3: Header, 3-Pin; LatestRevisionDate: 17-Jul-2002; LatestRevisionNote: Re-released for DXP Platform.; Publisher: Altium Limited
P12 = Header 6: Header, 6-Pin; LatestRevisionDate: 17-Jul-2002; LatestRevisionNote: Re-released for DXP Platform.; Publisher: Altium Limited
P13 = Header 5X2: Header, 5-Pin, Dual row; LatestRevisionDate: 17-Jul-2002; LatestRevisionNote: Re-released for DXP Platform.; Publisher: Altium Limited
Q7-Q9 = MOSFET-N 3pin: N MOS
R32-R81 = Res1: Resistor; Revision: July-2002: Re-released for DXP Platform.
U4 = DS2482-100: Single-Channel 1-Wire Master
U5 = ST3232CDR: 3 to 5.5 V, low power, up to 400 kbps RS-232 driver; Part Number: STm ST3232CDR; Purchase Code: Digikey 497-3731-6-ND
U6 = SN65HVD12: 3.3V to RS485 interface

## Sheet output.SchDoc: SIPO output board
size A3; Author: Francesco Sacchi <batt@develer.com>; Organization: Develer s.r.l.; Address1: via Mugellese 1/A; Address2: 50019 Campi Bisenzio; Address3: Firenze; Address4: ITALY; DocumentNumber: 1; Revision: 0; SheetNumber: 1; SheetTotal: 6
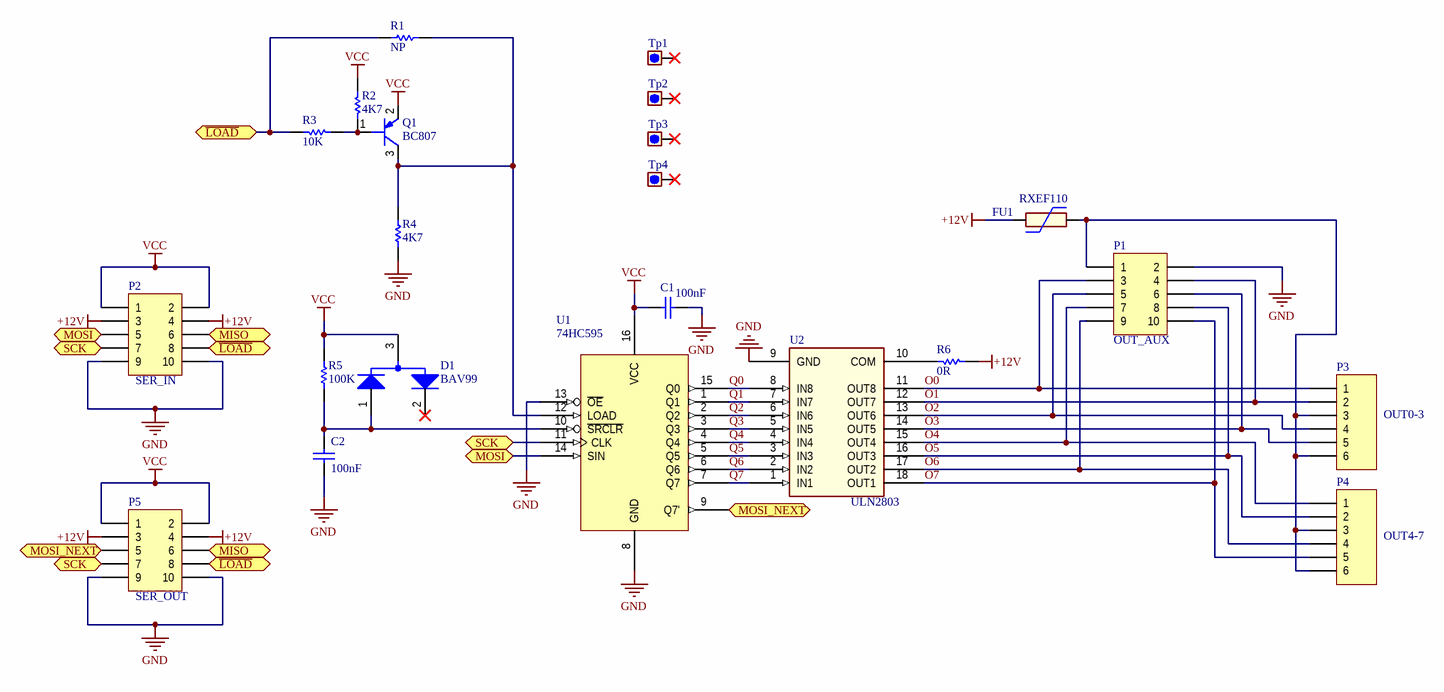
[diagram p3: output.SchDoc]

### Parts
(Parts that share a designator on the sheet are numbered #1, #2 ... from top to bottom, then left to right.)
C1#2  100nF  [0603_[1608]]
C2#2  100nF  [0603_[1608]]
D1#2  BAV99  [SOT-23]
FU1#1  RXEF110  [RADIAL_5.08mm_polyswitch]
P1#2  OUT_AUX  [HEADER_2X5_2.54MM_THD_BOXED]
P2#2  SER_IN  [HEADER_2X5_2.54MM_THD_BOXED]
P3#2  OUT0-3  [TBLOCK_1X6_3.5MM_HOR_THD]
P4#2  OUT4-7  [TBLOCK_1X6_3.5MM_HOR_THD]
P5#1  SER_OUT  [HEADER_2X5_2.54MM_THD_BOXED]
Q1#1  BC807  [SOT-23]
R1#2  NP  [0603_[1608]]
R2#2  4K7  [0603_[1608]]
R3#2  10K  [0603_[1608]]
R4#2  4K7  [0603_[1608]]
R5#2  100K  [0603_[1608]]
R6#2  0R  [0603_[1608]]
Tp1#2  (no value)  [Hole_M3x6mm]  (no BOM)
Tp2#2  (no value)  [Hole_M3x6mm]  (no BOM)
Tp3#2  (no value)  [Hole_M3x6mm]  (no BOM)
Tp4#2  (no value)  [Hole_M3x6mm]  (no BOM)
U1#2  74HC595  [SOIC16]
U2#1  ULN2803  [SOIC18]

### Ports
MISO, MOSI, MOSI_NEXT, SCK, ~{LOAD}

### Nets
+12V: FU1#1.1 P2#2.3 P2#2.4 P5#1.3 P5#1.4 R6#2.1
GND: C1#2.1 C2#2.1 P1#2.2 P2#2.9 P2#2.10 P5#1.9 P5#1.10 R4#2.2 U1#2.8(GND) U1#2.13(~{OE}) U2#1.9(GND)
VCC: C1#2.2 D1#2.3 P2#2.1 P2#2.2 P5#1.1 P5#1.2 Q1#1.2(E) R2#2.2 R5#2.2 U1#2.16(VCC)
O0: P1#2.3 P3#2.1 U2#1.11(OUT8)
O1: P1#2.4 P3#2.2 U2#1.12(OUT7)
O2: P1#2.5 P3#2.4 U2#1.13(OUT6)
O3: P1#2.6 P3#2.5 U2#1.14(OUT5)
O4: P1#2.7 P4#2.1 U2#1.15(OUT4)
O5: P1#2.8 P4#2.2 U2#1.16(OUT3)
O6: P1#2.9 P4#2.4 U2#1.17(OUT2)
O7: P1#2.10 P4#2.5 U2#1.18(OUT1)
Q0: U1#2.15(Q0) U2#1.8(IN8)
Q1: U1#2.1(Q1) U2#1.7(IN7)
Q2: U1#2.2(Q2) U2#1.6(IN6)
Q3: U1#2.3(Q3) U2#1.5(IN5)
Q4: U1#2.4(Q4) U2#1.4(IN4)
Q5: U1#2.5(Q5) U2#1.3(IN3)
Q6: U1#2.6(Q6) U2#1.2(IN2)
Q7: U1#2.7(Q7) U2#1.1(IN1)
NetC2#2_2: C2#2.2 D1#2.1 R5#2.1 U1#2.10(~{SRCLR})
NetFU1#1_2: FU1#1.2 P1#2.1 P3#2.3 P3#2.6 P4#2.3 P4#2.6
NetP1#1_5: P2#2.5 U1#2.14(SIN) ; port MOSI
NetP1#1_6: P2#2.6 P5#1.6 ; port MISO
NetP1#1_7: P2#2.7 P5#1.7 U1#2.11(CLK) ; port SCK
NetP1#1_8: P2#2.8 P5#1.8 R1#2.2 R3#2.2 ; port ~{LOAD}
NetP5#1_5: P5#1.5 U1#2.9(Q7') ; port MOSI_NEXT
NetQ1#1_1: Q1#1.1(B) R2#2.1 R3#2.1
NetQ1#1_3: Q1#1.3(C) R1#2.1 R4#2.1 U1#2.12(LOAD)
NetR6#2_2: R6#2.2 U2#1.10(COM)

Not connected (* = marked no-connect by the designer): D1#2 2*; Tp1#2 1*; Tp2#2 1*; Tp3#2 1*; Tp4#2 1*

### Notes on the sheet
- Title:
- Author:
- License:
- BSD
- Rev:
- Size:
- A3
- File:
- Date:
- Time:
- Sheet
- of

### Library data of the parts
C1#2 C2#2 = Cap: Ceramic X5R 6.3V, 10V; Value: 10nF; Published: 8-Jun-2000; Revision: July-2002: Re-released for DXP Platform.; Publisher: Altium Limited
D1#2 = BAV99: SOT23
FU1#1 = FuseAutoReset: Fuse
P1#2 P2#2 P5#1 = Header 5X2: Header, 5-Pin, Dual row; LatestRevisionDate: 17-Jul-2002; LatestRevisionNote: Re-released for DXP Platform.; Publisher: Altium Limited
P3#2 P4#2 = Header 6: Header, 6-Pin; LatestRevisionDate: 17-Jul-2002; LatestRevisionNote: Re-released for DXP Platform.; Publisher: Altium Limited
Q1#1 = BC807: PNP transistor
R1#2 R2#2 R3#2 R4#2 R5#2 R6#2 = Res1: Resistor; Value: 1K; Published: 8-Jun-2000; Revision: July-2002: Re-released for DXP Platform.; Publisher: Altium Limited
Tp1#2 Tp2#2 Tp3#2 Tp4#2 = Test_point
U1#2 = 74HC595: 8-bit shift register with 3-state output registers
U2#1 = ULN2803: BJT Darlinton Array

## Sheet power.SchDoc: Power supply
size A3; Author: Francesco Sacchi <batt@develer.com>; Organization: Develer s.r.l.; Address1: via Mugellese 1/A; Address2: 50019 Campi Bisenzio; Address3: Firenze; Address4: ITALY; DocumentNumber: 1; Revision: 0; SheetNumber: 1; SheetTotal: 6
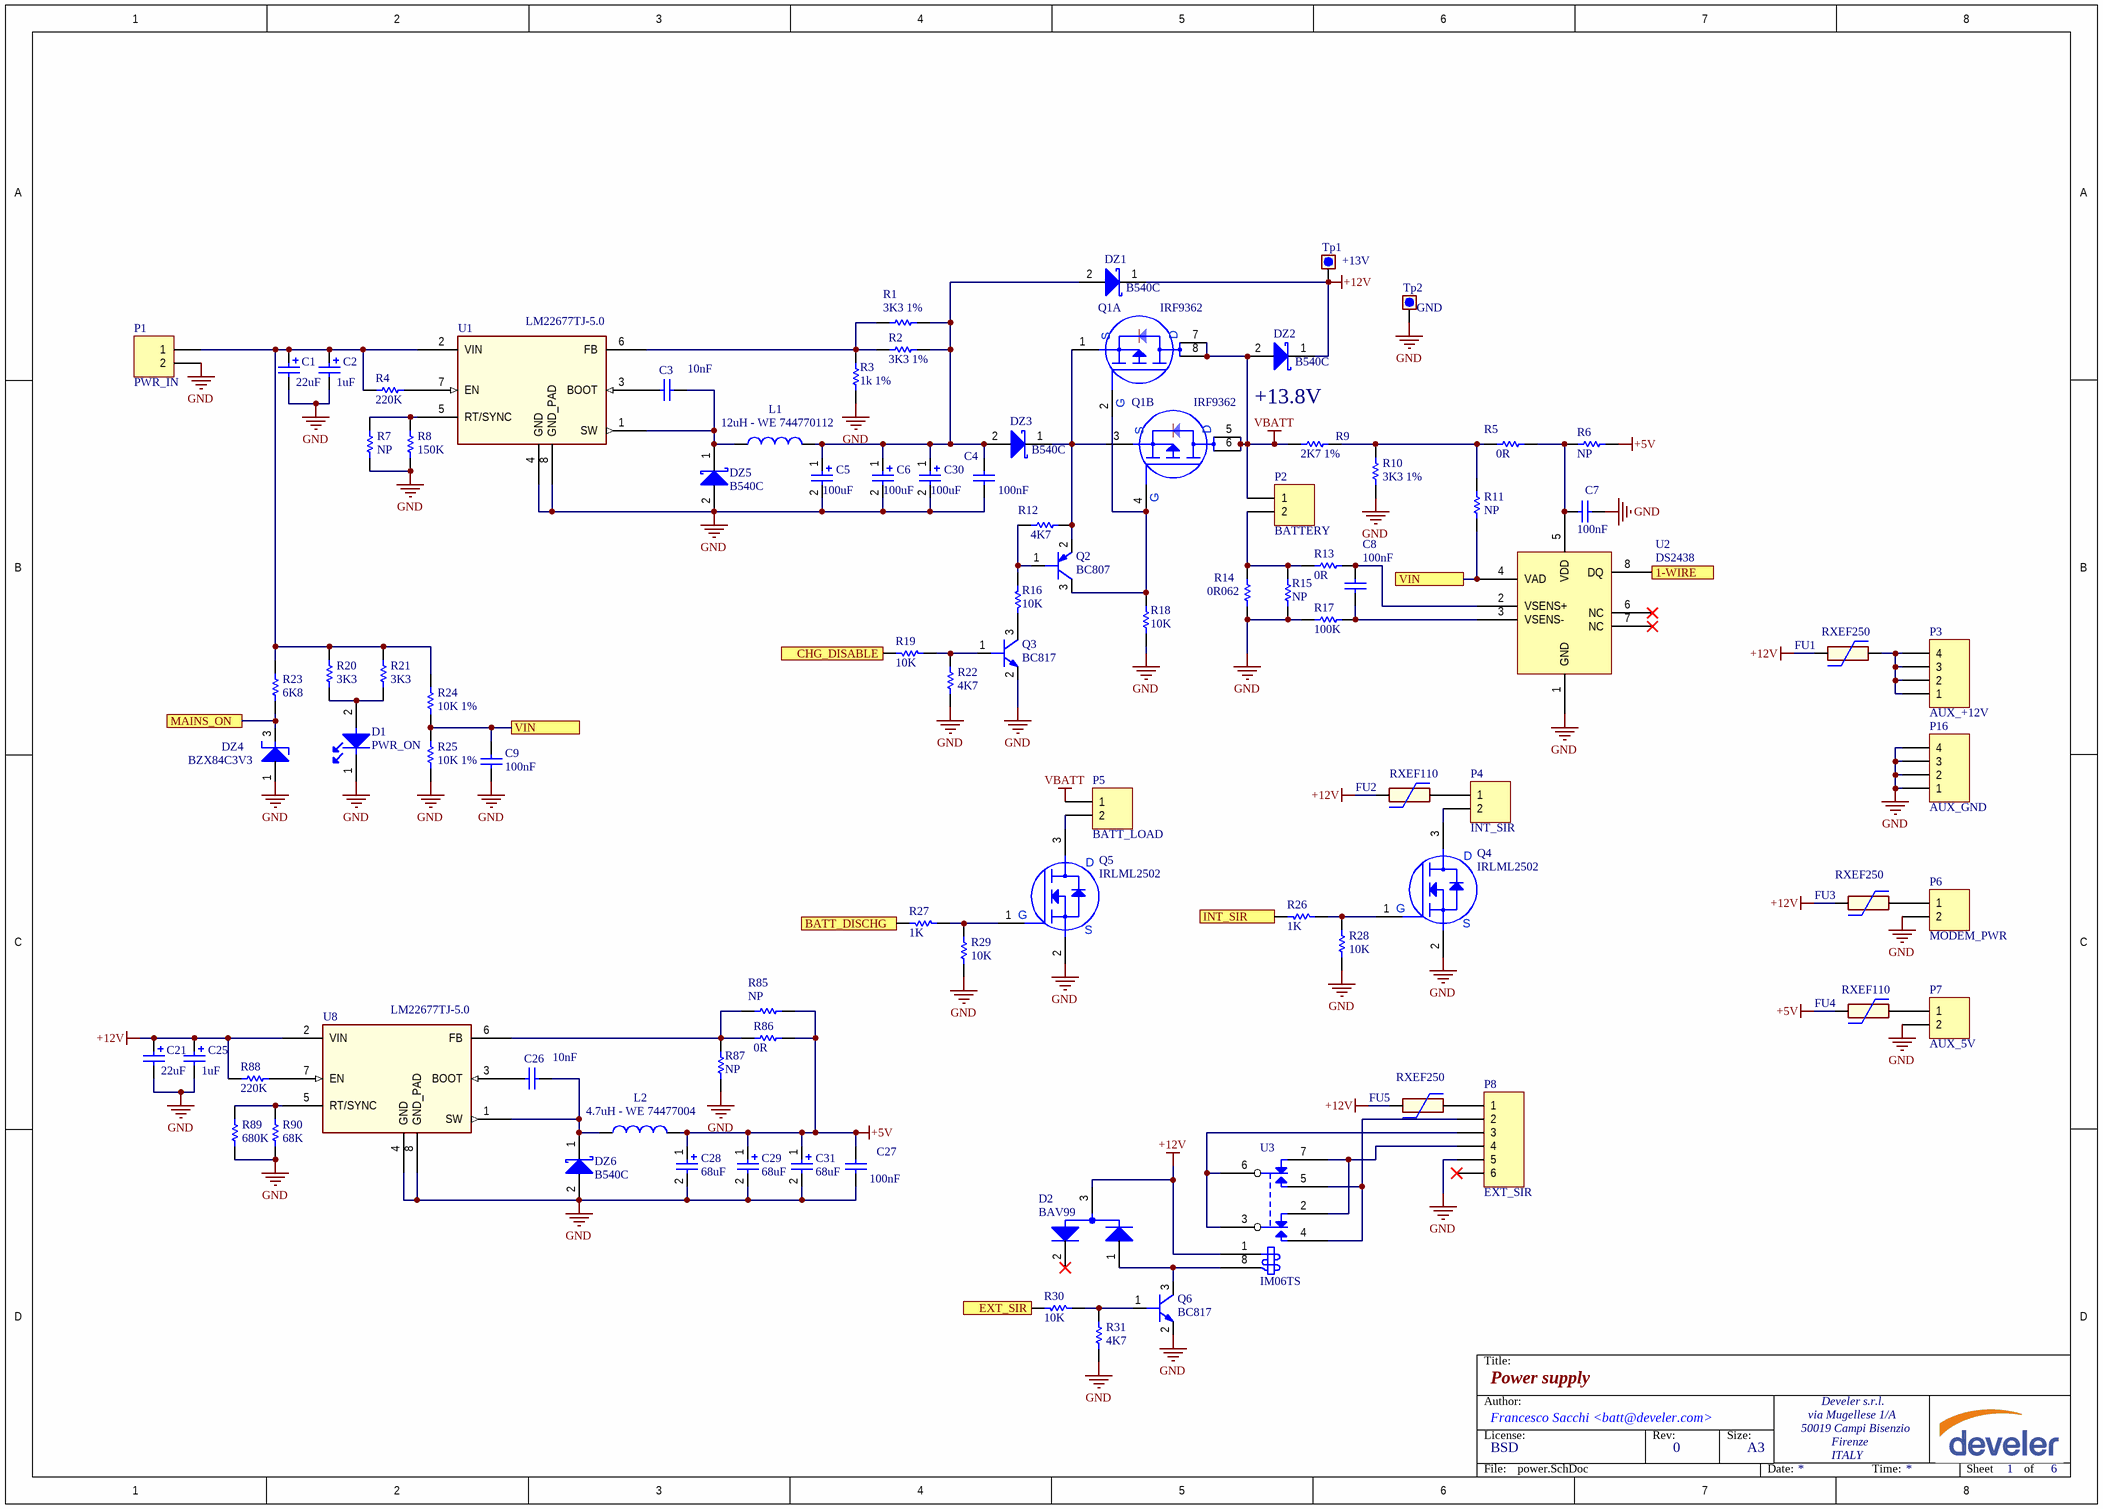
[diagram p4: power.SchDoc]

### Parts
(Parts that share a designator on the sheet are numbered #1, #2 ... from top to bottom, then left to right.)
C1#3  22uF  [1206_[3216]]
C2#3  1uF  [1206_[3216]]
C3#2  10nF  [0603_[1608]]
C4#2  100nF  [0603_[1608]]
C5#2  100uF  [[7343]_CAP_TAN]
C6#2  100uF  [[7343]_CAP_TAN]
C7#2  100nF  [0603_[1608]]
C8#2  100nF  [0603_[1608]]
C9#2  100nF  [0603_[1608]]
C21  22uF  [1206_[3216]]
C25  1uF  [1206_[3216]]
C26  10nF  [0603_[1608]]
C27  100nF  [0603_[1608]]
C28  68uF  [[7343]_CAP_TAN]
C29  68uF  [[7343]_CAP_TAN]
C30  100uF  [[7343]_CAP_TAN]
C31  68uF  [[7343]_CAP_TAN]
D1#3  PWR_ON  [0805_[2012]_LED]
D2#2  BAV99  [SOT-23]
DZ1  B540C  [DO214AB_K1-A2_SMC]
DZ2  B540C  [DO214AB_K1-A2_SMC]
DZ3  B540C  [DO214AB_K1-A2_SMC]
DZ4  BZX84C3V3  [SOT-23_L]
DZ5  B540C  [DO214AB_K1-A2_SMC]
DZ6  B540C  [DO214AB_K1-A2_SMC]
FU1#2  RXEF250  [RADIAL-10.2mm-polyswitch]
FU2  RXEF110  [RADIAL_5.08mm_polyswitch]
FU3  RXEF250  [RADIAL-10.2mm-polyswitch]
FU4  RXEF110  [RADIAL_5.08mm_polyswitch]
FU5  RXEF250  [RADIAL-10.2mm-polyswitch]
L1  12uH - WE 744770112  [WE-PD_1280]
L2  4.7uH - WE 74477004  [WE-PD_1280]
P1#3  PWR_IN  [TBLOCK_1X2_3.5MM_HOR_THD]
P2#3  BATTERY  [TBLOCK_1X2_3.5MM_HOR_THD]
P3#3  AUX_+12V  [TBLOCK_1X4_3.5MM_HOR_THD]
P4#3  INT_SIR  [TBLOCK_1X2_3.5MM_HOR_THD]
P5#2  BATT_LOAD  [TBLOCK_1X2_3.5MM_HOR_THD]
P6  MODEM_PWR  [TBLOCK_1X2_3.5MM_HOR_THD]
P7  AUX_5V  [TBLOCK_1X2_3.5MM_HOR_THD]
P8  EXT_SIR  [TBLOCK_1X6_3.5MM_HOR_THD]
P16  AUX_GND  [TBLOCK_1X4_3.5MM_HOR_THD]
Q1#2  IRF9362  [SOIC8]  (parts A,B of 2)
Q2  BC807  [SOT-23]
Q3  BC817  [SOT-23]
Q4  IRLML2502  [sot-23]
Q5  IRLML2502  [sot-23]
Q6  BC817  [SOT-23]
R1#3  3K3 1%  [0603_[1608]]
R2#3  3K3 1%  [0603_[1608]]
R3#3  1k 1%  [0603_[1608]]
R4#3  220K  [0603_[1608]]
R5#3  0R  [0603_[1608]]
R6#3  NP  [0603_[1608]]
R7#2  NP  [0603_[1608]]
R8#2  150K  [0603_[1608]]
R9#2  2K7 1%  [0603_[1608]]
R10#2  3K3 1%  [0603_[1608]]
R11#2  NP  [0603_[1608]]
R12#2  4K7  [0603_[1608]]
R13#2  0R  [0603_[1608]]
R14#2  0R062  [1020_[2550]]
R15#2  NP  [0603_[1608]]
R16#2  10K  [0603_[1608]]
R17#2  100K  [0603_[1608]]
R18  10K  [0603_[1608]]
R19  10K  [0603_[1608]]
R20  3K3  [0603_[1608]]
R21  3K3  [0603_[1608]]
R22  4K7  [0603_[1608]]
R23  6K8  [0603_[1608]]
R24  10K 1%  [0603_[1608]]
R25  10K 1%  [0603_[1608]]
R26  1K  [0603_[1608]]
R27  1K  [0603_[1608]]
R28  10K  [0603_[1608]]
R29  10K  [0603_[1608]]
R30  10K  [0603_[1608]]
R31  4K7  [0603_[1608]]
R85  NP  [0603_[1608]]
R86  0R  [0603_[1608]]
R87  NP  [0603_[1608]]
R88  220K  [0603_[1608]]
R89  680K  [0603_[1608]]
R90  68K  [0603_[1608]]
Tp1#3  +13V  [TEST_POINT_THD_D1.6MM]  (no BOM)
Tp2#3  GND  [TEST_POINT_THD_D1.6MM]  (no BOM)
U1#3  LM22677TJ-5.0  [TO-263-7]
U2#2  DS2438  [SOIC8]
U3  IM06TS  [RELAYS_DPST_THD_6x10_3.2mm]
U8  LM22677TJ-5.0  [TO-263-7]

### Ports
1-WIRE, BATT_DISCHG, CHG_DISABLE, EXT_SIR, INT_SIR, MAINS_ON, VIN

### Nets
+5V: C27.2 C28.1 C29.1 C31.1 FU4.1 L2.2 R6#3.1 R85.1 R86.1
+12V: C21.1 C25.1 D2#2.3 DZ1.1(K) DZ2.1(K) FU1#2.1 FU2.1 FU3.1 FU5.1 R88.1 Tp1#3.1 U3.1 U8.2(VIN)
GND: C1#3.2 C2#3.2 C4#2.1 C5#2.2 C6#2.2 C7#2.1 C9#2.1 C21.2 C25.2 C27.1 C28.2 C29.2 C30.2 C31.2 D1#3.1(K) DZ4.1(A) DZ5.2(A) DZ6.2(A) P1#3.2 P6.2 P7.2 P8.5 P16.1 P16.2 P16.3 P16.4 Q3.2(E) Q4.2(S) Q5.2(S) Q6.2(E) R3#3.2 R7#2.1 R8#2.1 R10#2.1 R14#2.2 R15#2.2 R17#2.1 R18.1 R22.1 R25.1 R28.1 R29.1 R31.1 R87.2 R89.1 R90.1 Tp2#3.1 U1#3.4(GND) U1#3.8(GND_PAD) U2#2.1(GND) U8.4(GND) U8.8(GND_PAD)
VBATT: DZ2.2(A) P2#3.1 P5#2.1 Q1#2.5(D) Q1#2.6(D) Q1#2.7(D) Q1#2.8(D) R9#2.2
NetC1#3_1: C1#3.1 C2#3.1 P1#3.1 R4#3.1 R20.2 R21.2 R23.2 R24.2 U1#3.2(VIN)
NetC3#2_1: C3#2.1 U1#3.3(BOOT)
NetC3#2_2: C3#2.2 DZ5.1(K) L1.1 U1#3.1(SW)
NetC4#2_2: C4#2.2 C5#2.1 C6#2.1 C30.1 DZ1.2(A) DZ3.2(A) L1.2 R1#3.1 R2#3.1
NetC7#2_2: C7#2.2 R5#3.1 R6#3.2 U2#2.5(VDD)
NetC8#2_1: C8#2.1 R17#2.2 U2#2.3(VSENS-)
NetC8#2_2: C8#2.2 R13#2.2 U2#2.2(VSENS+)
NetC9#2_2: C9#2.2 R11#2.1 R24.1 R25.2 U2#2.4(VAD) ; port VIN
NetC26_1: C26.1 U8.3(BOOT)
NetC26_2: C26.2 DZ6.1(K) L2.1 U8.1(SW)
NetD1#3_2: D1#3.2(A) R20.1 R21.1
NetD2#2_1: D2#2.1 Q6.3(C) U3.8
NetD3#2_1: U2#2.8(DQ) ; port 1-WIRE
NetDZ3_1: DZ3.1(K) Q1#2.1(S) Q1#2.3(S) Q2.2(E) R12#2.2
NetDZ4_3: DZ4.3(K) R23.1 ; port MAINS_ON
NetFU1#2_2: FU1#2.2 P3#3.1 P3#3.2 P3#3.3 P3#3.4
NetFU2_2: FU2.2 P4#3.1
NetFU3_2: FU3.2 P6.1
NetFU4_2: FU4.2 P7.1
NetFU5_2: FU5.2 P8.1
NetP2#3_2: P2#3.2 R13#2.1 R14#2.1 R15#2.1
NetP4#3_2: P4#3.2 Q4.3(D)
NetP5#2_2: P5#2.2 Q5.3(D)
NetP8_2: P8.2 U3.4 U3.5
NetP8_3: P8.3 U3.3 U3.6
NetP8_4: P8.4 U3.2 U3.7
NetQ1#2_2: Q1#2.2(G) Q1#2.4(G) Q2.3(C) R18.2
NetQ2_1: Q2.1(B) R12#2.1 R16#2.2
NetQ3_1: Q3.1(B) R19.2 R22.2
NetQ3_3: Q3.3(C) R16#2.1
NetQ4_1: Q4.1(G) R26.2 R28.2
NetQ5_1: Q5.1(G) R27.2 R29.2
NetQ6_1: Q6.1(B) R30.2 R31.2
NetR1#3_2: R1#3.2 R2#3.2 R3#3.1 U1#3.6(FB)
NetR4#3_2: R4#3.2 U1#3.7(EN)
NetR5#3_2: R5#3.2 R9#2.1 R10#2.2 R11#2.2
NetR7#2_2: R7#2.2 R8#2.2 U1#3.5(RT/SYNC)
NetR19_1: R19.1 ; port CHG_DISABLE
NetR26_1: R26.1 ; port INT_SIR
NetR27_1: R27.1 ; port BATT_DISCHG
NetR30_1: R30.1 ; port EXT_SIR
NetR85_2: R85.2 R86.2 R87.1 U8.6(FB)
NetR88_2: R88.2 U8.7(EN)
NetR89_2: R89.2 R90.2 U8.5(RT/SYNC)

Not connected (* = marked no-connect by the designer): D2#2 2*; P8 6*; U2#2 6(NC)* 7(NC)*

### Notes on the sheet
- +13.8V
- Title:
- Author:
- License:
- BSD
- Rev:
- Size:
- A3
- File:
- Date:
- Time:
- Sheet
- of

### Library data of the parts
C1#3 C2#3 C21 C25 = Cap Pol1: Ceramic X7R 50V; Value: 10uF; Published: 8-Jun-2000; Revision: July-2002: Re-released for DXP Platform.; Publisher: Altium Limited
C3#2 C4#2 C7#2 C8#2 C9#2 C26 C27 = Cap: Ceramic X7R 50V; Value: 100pF; Published: 8-Jun-2000; LatestRevisionDate: 17-Jul-2002; LatestRevisionNote: Re-released for DXP Platform.; PackageReference: RAD-0.3; Publisher: Altium Limited; PackageDescription: Radial Cap, Thru-Hole; 2 Leads; 0.3 in Pin Spacing
C5#2 C6#2 C28-C31 = Cap Pol1: Tantalum 25V T491X107K025AT; Value: 10uF; Published: 8-Jun-2000; Revision: July-2002: Re-released for DXP Platform.; Publisher: Altium Limited
D1#3 = LED: Multicolor LED
D2#2 = BAV99: SOT23
DZ1-DZ3 DZ5 DZ6 = D Schottky: Diode Schottky (SSC54); Published: 8-Jun-2000; LatestRevisionDate: 17-Jul-2002; LatestRevisionNote: Re-released for DXP Platform.; PackageReference: SMB; Publisher: Altium Limited; PackageDescription: DO-214-AA/SMB; 2 C-Bend Leads; Body 5.3 x 3.6 mm, inc. leads (LxW); Code_JEDEC: DO-214-AA
DZ4 = ZENER_BZX: Zener 0.35W
FU1#2 FU2-FU5 = FuseAutoReset: Fuse autoreset
L1 L2 = Inductor: SMD Shielded Tiny Power Inductor; Code_IEC: 1005; Value: 10mH; Published: 8-Jun-2000; LatestRevisionDate: 29-May-2009; LatestRevisionNote: IPC-7351 Footprint Added.; PackageReference: 0402-A; Publisher: Altium Limited; PackageDescription: Chip Inductor; Code_JEITA: 0402
P1#3 P2#3 P4#3 P5#2 P6 P7 = Header 2: Header, 2-Pin; LatestRevisionDate: 17-Jul-2002; LatestRevisionNote: Re-released for DXP Platform.; Publisher: Altium Limited
P3#3 P16 = Header 4: Header, 4-Pin; LatestRevisionDate: 17-Jul-2002; LatestRevisionNote: Re-released for DXP Platform.; Publisher: Altium Limited
P8 = Header 6: Header, 6-Pin; LatestRevisionDate: 17-Jul-2002; LatestRevisionNote: Re-released for DXP Platform.; Publisher: Altium Limited
Q1#2 = MOSFET-P dual: Dual channel P-MOS in same package
Q2 = BC807: PNP Trasistor
Q3 Q6 = BC817: NPN Transistor
Q4 Q5 = MOSFET-N 3pin: N MOS
R1#3 R2#3 R3#3 R4#3 R5#3 R6#3 R7#2 R8#2 R9#2 R10#2 R11#2 R12#2 R13#2 R14#2 R15#2 R16#2 R17#2 R18-R31 R85-R90 = Res1: Resistor; Revision: July-2002: Re-released for DXP Platform.
Tp1#3 Tp2#3 = Test_point
U1#3 U8 = LM22670TJ-ADJ: Switching regulator.
U2#2 = DS2438: Smart Battery Monitor
U3 = RELAY DPST

## Nets that join several sheets
+3.3V: eva01_connectors (5 pins), interface (20 pins)
+5V: eva01_connectors (J2.4 J3.4 J4.2), interface (6 pins), power (9 pins)
+12V: eva01_connectors (J3.51), input (P1#1.3 P1#1.4 P2#1.3 P2#1.4), interface (FU7.1 FU8.1 P13.3 P13.4), output (6 pins), power (13 pins)
GND: eva01_connectors (19 pins), input (28 pins), interface (30 pins), output (11 pins), power (52 pins)
VCC: input (22 pins), output (10 pins)
NetD3#2_1: interface (D3#2.1 P10.2), power (U2#2.8)
NetDZ4_3: interface (R63.2), power (DZ4.3 R23.1)
NetJ2_45: eva01_connectors (J2.45), interface (R54.1)
NetJ2_47: eva01_connectors (J2.47), interface (R56.1)
NetJ2_49: eva01_connectors (J2.49), interface (R57.1)
NetJ2_51: eva01_connectors (J2.51), interface (R58.1)
NetJ3_12: eva01_connectors (J3.12), interface (R45.1)
NetJ3_14: eva01_connectors (J3.14), interface (R46.1)
NetJ3_22: eva01_connectors (J3.22), interface (R40.1)
NetJ3_24: eva01_connectors (J3.24), interface (R42.1)
NetJ3_25: eva01_connectors (J3.25), interface (R39.1)
NetJ3_28: eva01_connectors (J3.28), interface (R37.1)
NetJ3_30: eva01_connectors (J3.30), interface (R38.1)
NetJ3_48: eva01_connectors (J3.48), interface (R52.1)
NetJ3_50: eva01_connectors (J3.50), interface (R50.1)
NetJ4_9: eva01_connectors (J4.9), interface (R65.1)
NetJ4_11: eva01_connectors (J4.11), interface (R63.1)
NetJ4_12: eva01_connectors (J4.12), interface (R61.1)
NetJ4_13: eva01_connectors (J4.13), interface (R60.1)
NetJ4_17: eva01_connectors (J4.17), interface (R47.1)
NetJ4_23: eva01_connectors (J4.23), interface (R48.1)
NetJ4_27: eva01_connectors (J4.27), interface (R64.1)
NetJ4_28: eva01_connectors (J4.28), interface (R66.1)
NetJ4_40: eva01_connectors (J4.40), interface (R53.1)
NetJ4_43: eva01_connectors (J4.43), interface (R51.1)
NetP1#1_5: input (P1#1.5 P2#1.5), interface (P12.3 R51.2), output (P2#2.5 U1#2.14)
NetP1#1_6: input (P1#1.6 U1#1.9), interface (P12.2 R50.2), output (P2#2.6 P5#1.6)
NetP1#1_7: input (P1#1.7 P2#1.7 U1#1.2), interface (P12.4 R52.2), output (P2#2.7 P5#1.7 U1#2.11)
NetP1#1_8: input (P1#1.8 P2#1.8 U1#1.1), output (P2#2.8 P5#1.8 R1#2.2 R3#2.2)
NetR19_1: interface (R64.2), power (R19.1)
NetR26_1: interface (R60.2), power (R26.1)
NetR27_1: interface (R65.2), power (R27.1)
NetR30_1: interface (R61.2), power (R30.1)